# Altium schematic sheet Actuator.SchDoc
size A3
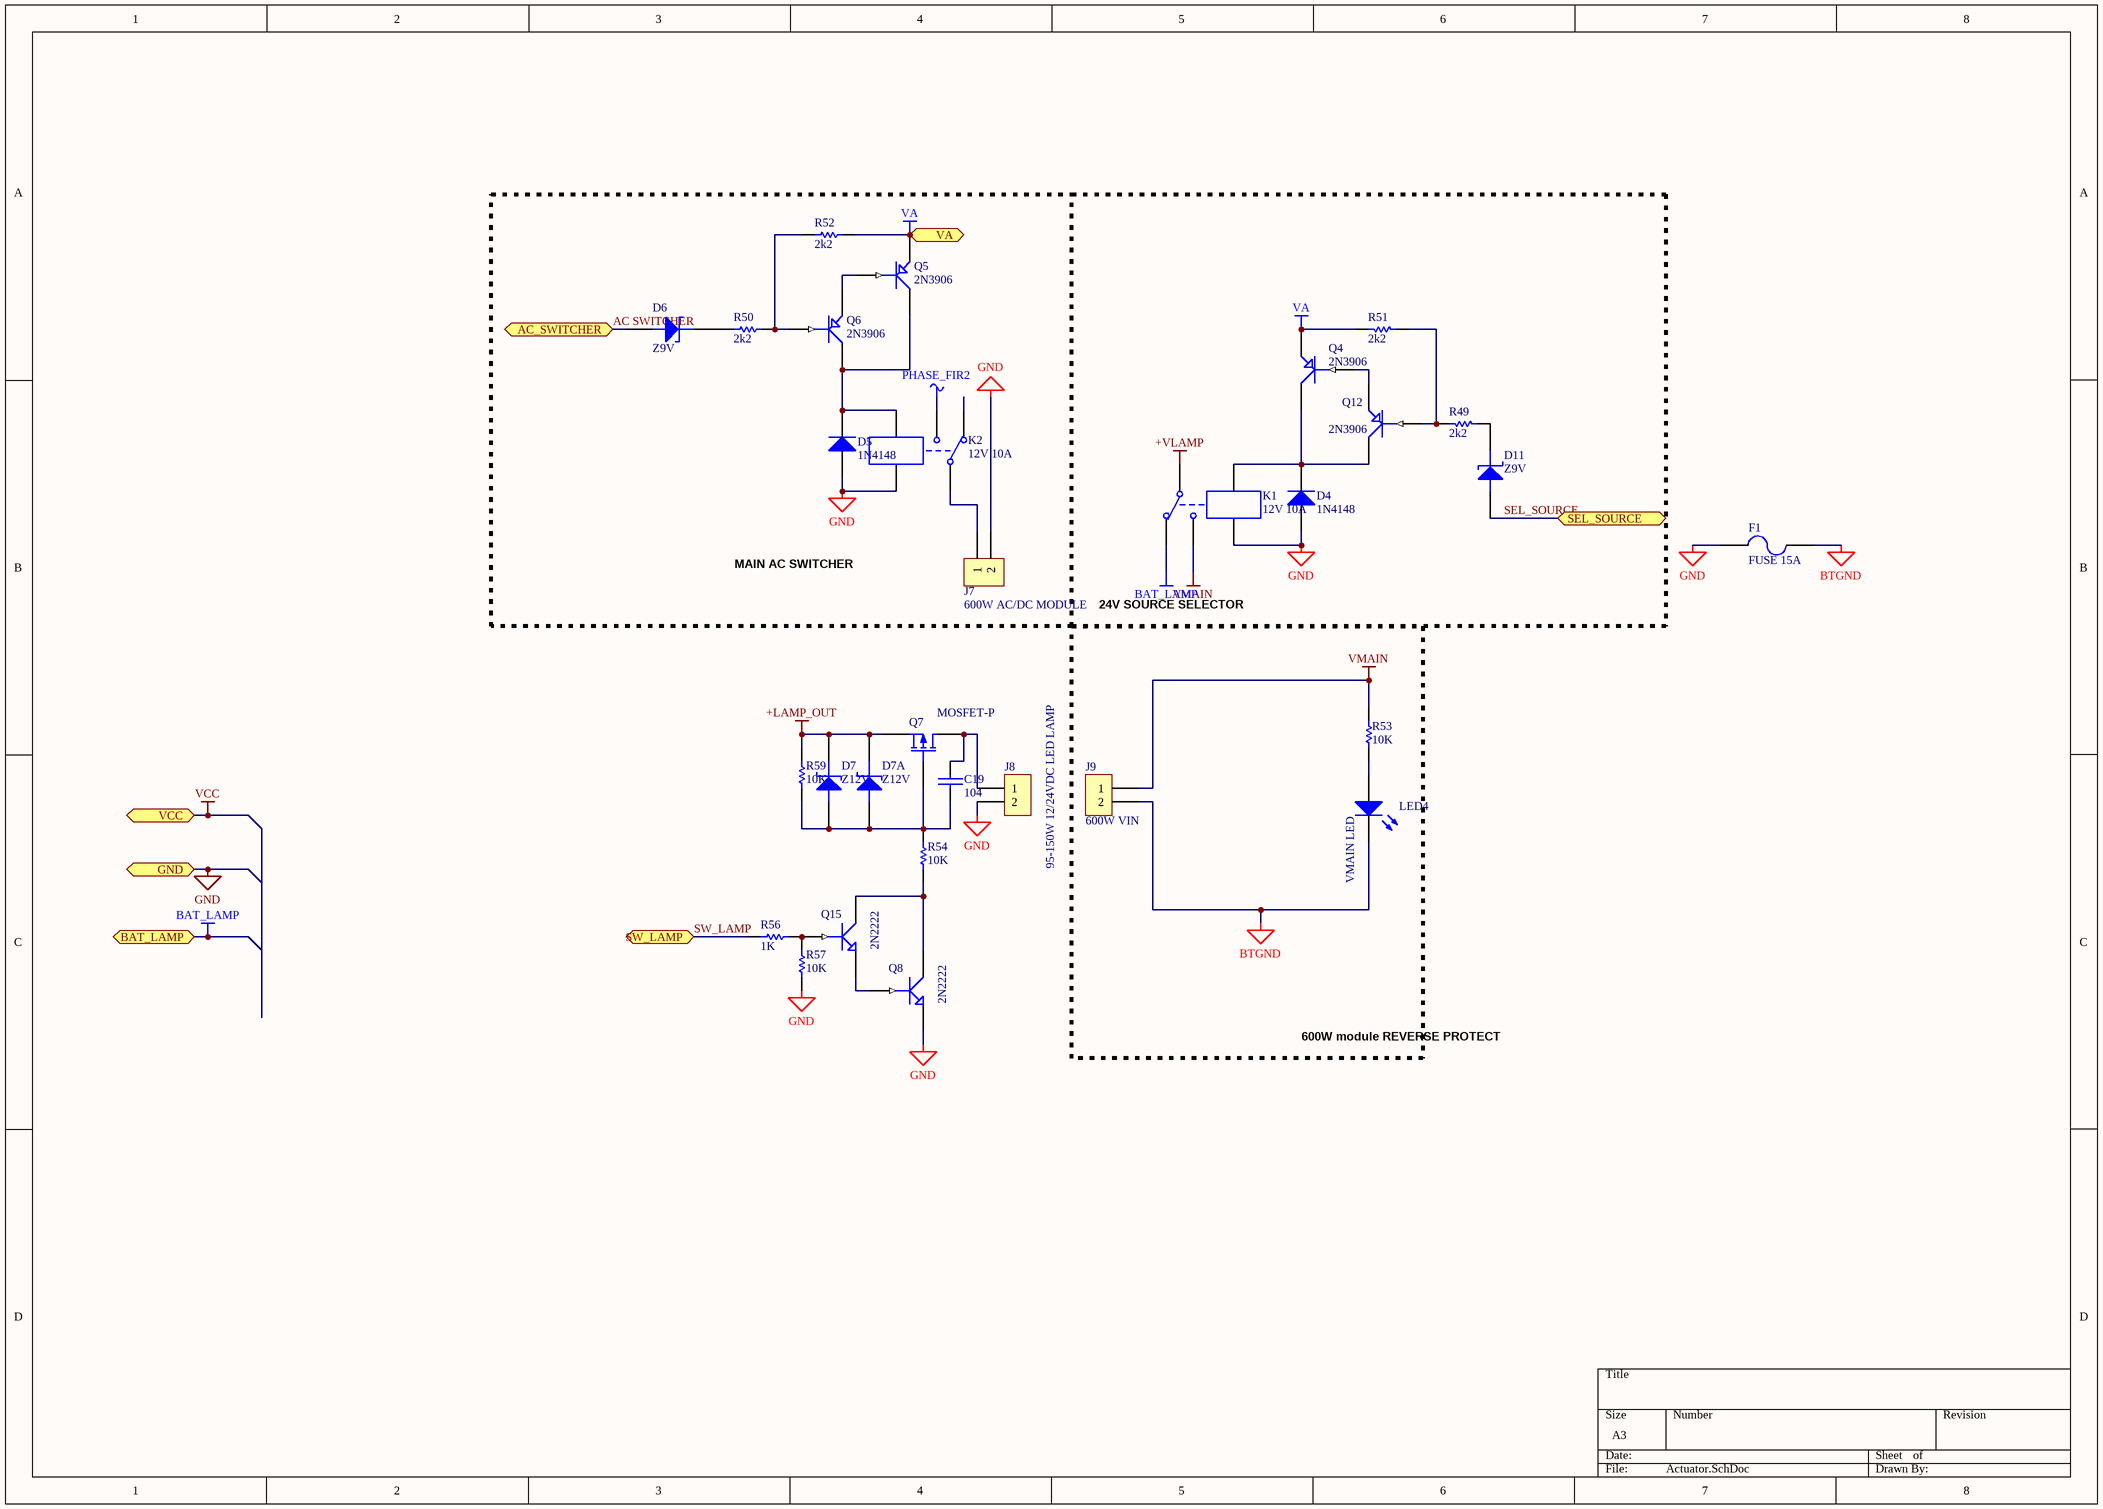
[diagram p0: Actuator.SchDoc]

## Parts
C19  104  [C6-0805_N]
D4  1N4148  [SOD80, LL-34]
D5  1N4148  [SOD80, LL-34]
D6  Z9V  [SOD80, LL-34]
D7  Z12V  [DO-35]
D7A  Z12V  [SOD80, LL-34]
D11  Z9V  [SOD80, LL-34]
F1  FUSE 15A  [FUSE2]
J7  600W AC/DC MODULE  [TERMINAL2]
J8  95-150W 12/24VDC LED LAMP  [TERMINAL2]
J9  600W VIN  [TERMINAL2]
K1  12V 10A  [RELAYVUONG]
K2  12V 10A  [RELAYVUONG]
LED4  VMAIN LED  [led3mm]
Q4  2N3906  [SOT23-3]
Q5  2N3906  [SOT23-3]
Q6  2N3906  [SOT23-3]
Q7  MOSFET-P  [D2PAK-3]
Q8  2N2222  [SOT23-3]
Q12  2N3906  [SOT23-3]
Q15  2N2222  [SOT23-3]
R49  2k2  [6-0805_N]
R50  2k2  [6-0805_N]
R51  2k2  [6-0805_N]
R52  2k2  [6-0805_N]
R53  10K  [6-0805_N]
R54  10K  [6-0805_N]
R56  1K  [6-0805_N]
R57  10K  [6-0805_N]
R59  10K  [6-0805_N]

## Blocks framed on the sheet
24V SOURCE SELECTOR: D4 D11 K1 Q4 Q12 R49 R51

## Ports
AC_SWITCHER, BAT_LAMP, GND, SEL_SOURCE, SW_LAMP, VA, VCC

## Nets
+LAMP_OUT: D7.2(K) D7A.2(K) Q7.3(S) R59.2
+VLAMP: K1.1
BAT_LAMP: K1.2 ; port BAT_LAMP
BTGND: F1.2 J9.2 LED4.2(K)
GND: D4.1(A) D5.1(A) F1.1 J7.2 J8.2 K1.5 K2.4 Q8.2(E) R57.1 ; port GND
PHASE_FIR2: K2.3
VA: Q4.2(E) Q5.2(E) R51.2 R52.2 ; port VA
VCC: port VCC
VMAIN: J9.1 K1.3 R53.2
AC SWITCHER: D6.1(A) ; port AC_SWITCHER
SEL_SOURCE: D11.1(A) ; port SEL_SOURCE
SW_LAMP: R56.1 ; port SW_LAMP
NetC19_1: C19.1 J8.1 Q7.2(D)
NetC19_2: C19.2 D7.1(A) D7A.1(A) Q7.1(G) R54.2 R59.1
NetD4_2: D4.2(K) K1.4 Q4.3(C) Q12.3(C)
NetD5_2: D5.2(K) K2.5 Q5.3(C) Q6.3(C)
NetD6_2: D6.2(K) R50.1
NetD11_2: D11.2(K) R49.1
NetJ7_1: J7.1 K2.1
NetLED4_1: LED4.1(A) R53.1
NetQ4_1: Q4.1(B) Q12.2(E)
NetQ5_1: Q5.1(B) Q6.2(E)
NetQ6_1: Q6.1(B) R50.2 R52.1
NetQ8_1: Q8.1(B) Q15.2(E)
NetQ8_3: Q8.3(C) Q15.3(C) R54.1
NetQ12_1: Q12.1(B) R49.2 R51.1
NetQ15_1: Q15.1(B) R56.2 R57.2

Not connected (* = marked no-connect by the designer): K2 2

## Notes on the sheet
- MAIN AC SWITCHER
- 600W module REVERSE PROTECT

## Library data of the parts
C19 = CAP: Capacitor
D4 D5 = Diode 1N4007: 1 Amp General Purpose Rectifier; pin to pad: 1>A 2>K; Published: 8-Jun-2000; LatestRevisionDate: 17-Jul-2002; LatestRevisionNote: Re-released for DXP Platform.; DatasheetDocument: 1998; PackageDocument: Aug-1999; PackageReference: DO-41; Publisher: Altium Limited; Code_JEDEC: DO-204-AL; ComponentLink1Description: Manufacturer Link; ComponentLink1URL: http://www.fairchildsemi.com/; ComponentLink2Description: Datasheet; ComponentLink2URL: http://www.fairchildsemi.com/ds/1N%2F1N4001.pdf
D6 D7A D11 = ZENER2: Zener Diode; pin to pad: 1>A 2>K
D7 = ZENER2: Zener Diode
F1 = FUSE2: Fuse
J7-J9 = CON2: Connector
K1 K2 = Relay-SPDT: G5LA-10A/250VAC / SRC-12VDC-SL-C; Published: 24-Mar-1999; LatestRevisionDate: 17-Jul-2002; LatestRevisionNote: Re-released for DXP Platform.; PackageReference: MODULE5B; Publisher: Altium Limited
LED4 = LED3: Typical BLUE SiC LED; Published: 8-Jun-2000; LatestRevisionDate: 17-Dec-2003; LatestRevisionNote: PCB Footprint replaced.; DatasheetVersion: 16-Apr-2002; PackageVersion: 16-Apr-2002; PackageReference: 3.5X2.8X1.9; Publisher: Altium Limited; PackageDescription: SM LED; 2 C-Bend Leads; Body 3.5 x 2.8 x 1.9 mm, inc leads (LxWxH typ)
Q4-Q6 Q12 = PNP1: PNP Transistor
Q7 = MOSFET-P: P-Channel MOSFET; pin to pad: 2>4; Published: 8-Jun-2000; LatestRevisionDate: 17-Jul-2002; LatestRevisionNote: Re-released for DXP Platform.; PackageVersion: 1995/1996; PackageReference: E3; Publisher: Altium Limited; PackageDescription: TO, Flat Index; 3 In-Line, Axial Leads; Body Dia. 4.6mm; Lead Dia. 0.5 mm (max)
Q8 Q15 = NPN1: NPN Transistor
R49 R50 R53 R57 = Res Semi: Semiconductor Resistor
  R49 R50: Published: 8-Jun-2000; LatestRevisionDate: 17-Jul-2002; LatestRevisionNote: Re-released for DXP Platform.; PackageReference: AXIAL-0.5; Publisher: Altium Limited; Value: 2K2
  R53: Published: *; LatestRevisionDate: *; LatestRevisionNote: *; PackageReference: *; Publisher: *; Value: *
  R57: Published: 8-Jun-2000; LatestRevisionDate: 17-Jul-2002; LatestRevisionNote: Re-released for DXP Platform.; PackageReference: AXIAL-0.5; Publisher: Altium Limited; Value: 10K
R51 R52 = Res Semi: Semiconductor Resistor; Value: 10K; Published: 8-Jun-2000; LatestRevisionDate: 17-Jul-2002; LatestRevisionNote: Re-released for DXP Platform.; PackageReference: AXIAL-0.5; Publisher: Altium Limited
R54 R56 R59 = Res Semi: Semiconductor Resistor; Value: 2K2; Published: 8-Jun-2000; LatestRevisionDate: 17-Jul-2002; LatestRevisionNote: Re-released for DXP Platform.; PackageReference: AXIAL-0.5; Publisher: Altium Limited